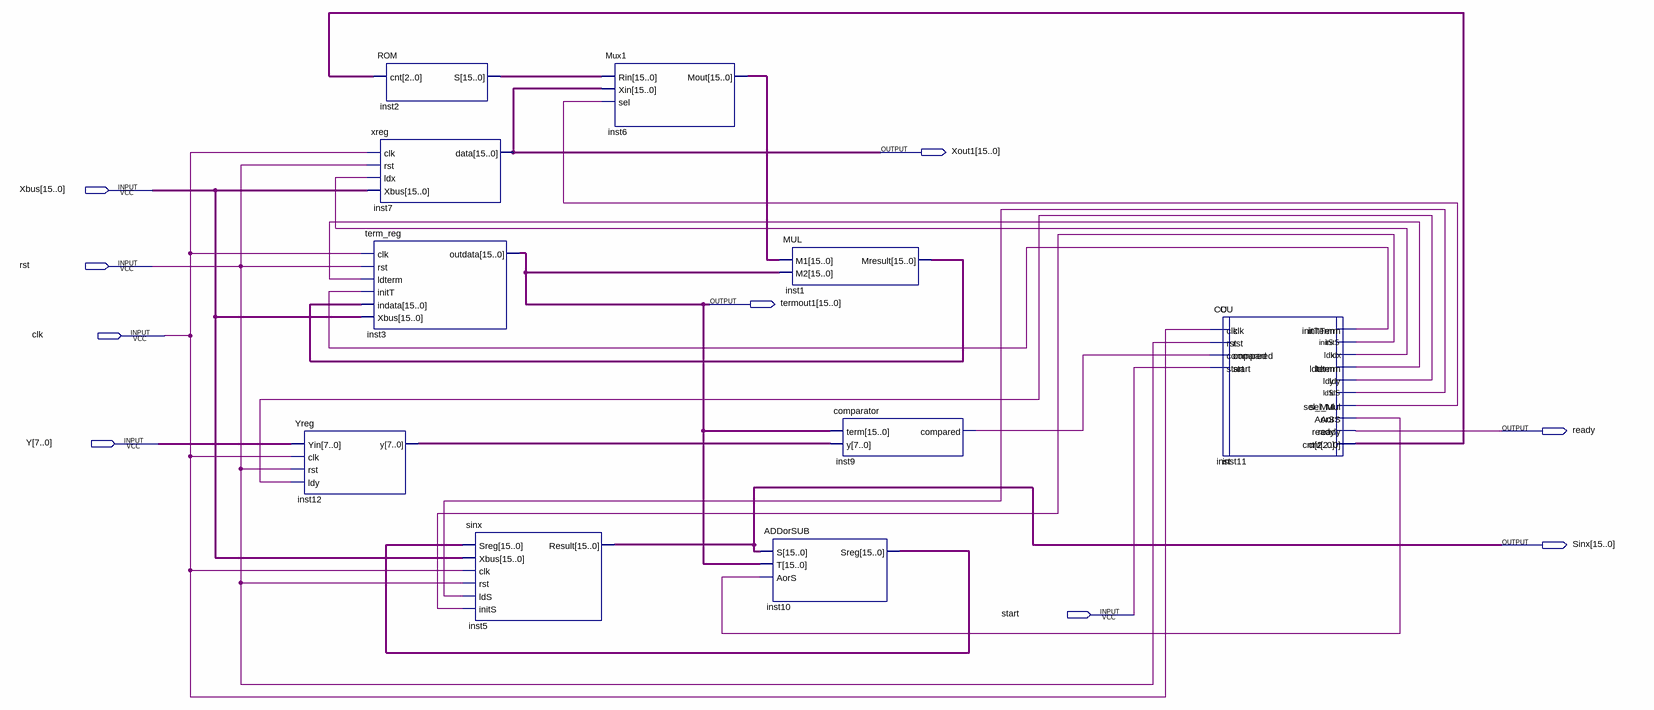
[diagram p0: schematic sheet]
// Quartus schematic CA6.bdf as structural Verilog: 11 symbols, 9 pins
module CA6 (
  input  [15:0] Xbus,
  input  rst,
  input  clk,
  input  [7:0] Y,
  input  start,
  output [15:0] Xout1,
  output [15:0] termout1,
  output ready,
  output [15:0] Sinx
);

  wire inst9_compared, inst11_aors, inst11_inits, inst11_initterm, inst11_lds, inst11_ldterm, inst11_ldx,
       inst11_ldy, inst11_sel_mul;
  wire [2:0] inst11_cnt;
  wire [7:0] inst12_y;
  wire [15:0] inst1_mresult, inst2_s, inst6_mout, inst10_sreg;

  Yreg inst12 (.Yin(Y), .clk(clk), .rst(rst), .ldy(inst11_ldy), .y(inst12_y));
  ROM inst2 (.cnt(inst11_cnt), .S(inst2_s));
  xreg inst7 (.clk(clk), .rst(rst), .ldx(inst11_ldx), .Xbus(Xbus), .data(Xout1));
  term_reg inst3 (
    .clk(clk), .rst(rst), .ldterm(inst11_ldterm), .initT(inst11_initterm), .indata(inst1_mresult),
    .Xbus(Xbus), .outdata(termout1));
  sinx inst5 (
    .Sreg(inst10_sreg), .Xbus(Xbus), .clk(clk), .rst(rst), .ldS(inst11_lds), .initS(inst11_inits),
    .Result(Sinx));
  Mux1 inst6 (.Rin(inst2_s), .Xin(Xout1), .sel(inst11_sel_mul), .Mout(inst6_mout));
  MUL inst1 (.M1(inst6_mout), .M2(termout1), .Mresult(inst1_mresult));
  ADDorSUB inst10 (.S(Sinx), .T(termout1), .AorS(inst11_aors), .Sreg(inst10_sreg));
  comparator inst9 (.term(termout1), .y(inst12_y), .compared(inst9_compared));
  CU inst (
    .clk(clk), .rst(rst), .compared(inst9_compared), .start(start));  // open: initTerm, initS, ldx, ldterm, ldy, ldS, sel_Mul, AorS, ready, cnt
  CU inst11 (
    .initTerm(inst11_initterm), .initS(inst11_inits), .ldx(inst11_ldx), .ldterm(inst11_ldterm),
    .ldy(inst11_ldy), .ldS(inst11_lds), .sel_Mul(inst11_sel_mul), .AorS(inst11_aors), .ready(ready),
    .cnt(inst11_cnt));  // open: clk, rst, compared, start
endmodule
